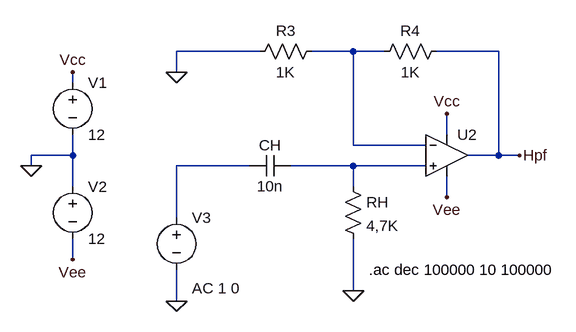
[diagram p0: schematic Apartado_B2.asc]
Apartado_B2.asc, the LTspice schematic file:
Version 4
SHEET 1 880 680
WIRE 320 64 192 64
WIRE 464 64 400 64
WIRE 512 64 464 64
WIRE 688 64 592 64
WIRE 192 96 192 64
WIRE 32 112 32 96
WIRE 608 192 608 160
WIRE 464 208 464 64
WIRE 576 208 464 208
WIRE 32 224 32 192
WIRE 32 224 -32 224
WIRE 688 224 688 64
WIRE 688 224 640 224
WIRE 720 224 688 224
WIRE -32 240 -32 224
WIRE 304 240 192 240
WIRE 464 240 368 240
WIRE 576 240 464 240
WIRE 32 272 32 224
WIRE 464 272 464 240
WIRE 608 288 608 256
WIRE 192 320 192 240
WIRE 32 384 32 352
WIRE 464 432 464 352
WIRE 192 448 192 400
FLAG 192 96 0
FLAG -32 240 0
FLAG 192 448 0
FLAG 464 432 0
FLAG 608 160 Vcc
FLAG 32 96 Vcc
FLAG 32 384 Vee
FLAG 608 288 Vee
FLAG 720 224 Hpf
SYMBOL voltage 32 96 R0
WINDOW 123 0 0 Left 2
WINDOW 39 0 0 Left 2
SYMATTR InstName V1
SYMATTR Value 12
SYMBOL voltage 32 256 R0
WINDOW 123 0 0 Left 2
WINDOW 39 0 0 Left 2
SYMATTR InstName V2
SYMATTR Value 12
SYMBOL voltage 192 304 R0
WINDOW 3 24 96 Invisible 2
WINDOW 123 24 124 Left 2
WINDOW 39 0 0 Left 2
SYMATTR InstName V3
SYMATTR Value SINE(0)
SYMATTR Value2 AC 1 0
SYMBOL res 416 48 R90
WINDOW 0 0 56 VBottom 2
WINDOW 3 32 56 VTop 2
SYMATTR InstName R3
SYMATTR Value 1K
SYMBOL res 608 48 R90
WINDOW 0 0 56 VBottom 2
WINDOW 3 32 56 VTop 2
SYMATTR InstName R4
SYMATTR Value 1K
SYMBOL res 448 256 R0
SYMATTR InstName RH
SYMATTR Value 4,7K
SYMBOL cap 368 224 R90
WINDOW 0 0 32 VBottom 2
WINDOW 3 32 32 VTop 2
SYMATTR InstName CH
SYMATTR Value 10n
SYMBOL Opamps\\UniversalOpamp2 608 224 R0
SYMATTR InstName U2
TEXT 488 400 Left 2 !.ac dec 100000 10 100000

The netlist it stands for:
* Apartado_B2.asc
V1 Vcc 0 12
V2 0 Vee 12
V3 N002 0 SINE(0) AC 1 0
R3 N001 0 1K
R4 Hpf N001 1K
RH N003 0 4,7K
CH N003 N002 10n
XU2 N003 N001 Vcc Vee Hpf level.2 Avol=1Meg GBW=10Meg Slew=10Meg ilimit=25m rail=0 Vos=0 phimargin=45 en=0 enk=0 in=0 ink=0 Rin=500Meg  ; pins IN+ IN- V+ V- OUT
.ac dec 100000 10 100000
.lib UniversalOpamps2.sub
.backanno
.end

* Results of the author's LTspice run, read from the files saved beside the schematic
* Operating Point, zero values left out:
*   V(vcc) = 12 V
*   V(vee) = -12 V
*   I(V2) = -1.199 mA
*   I(V1) = -1.199 mA
*   Ix(u2:3) = 1.199 mA
*   Ix(u2:4) = -1.199 mA